# EAGLE design wireless_interface (EAGLE 7.3.0)
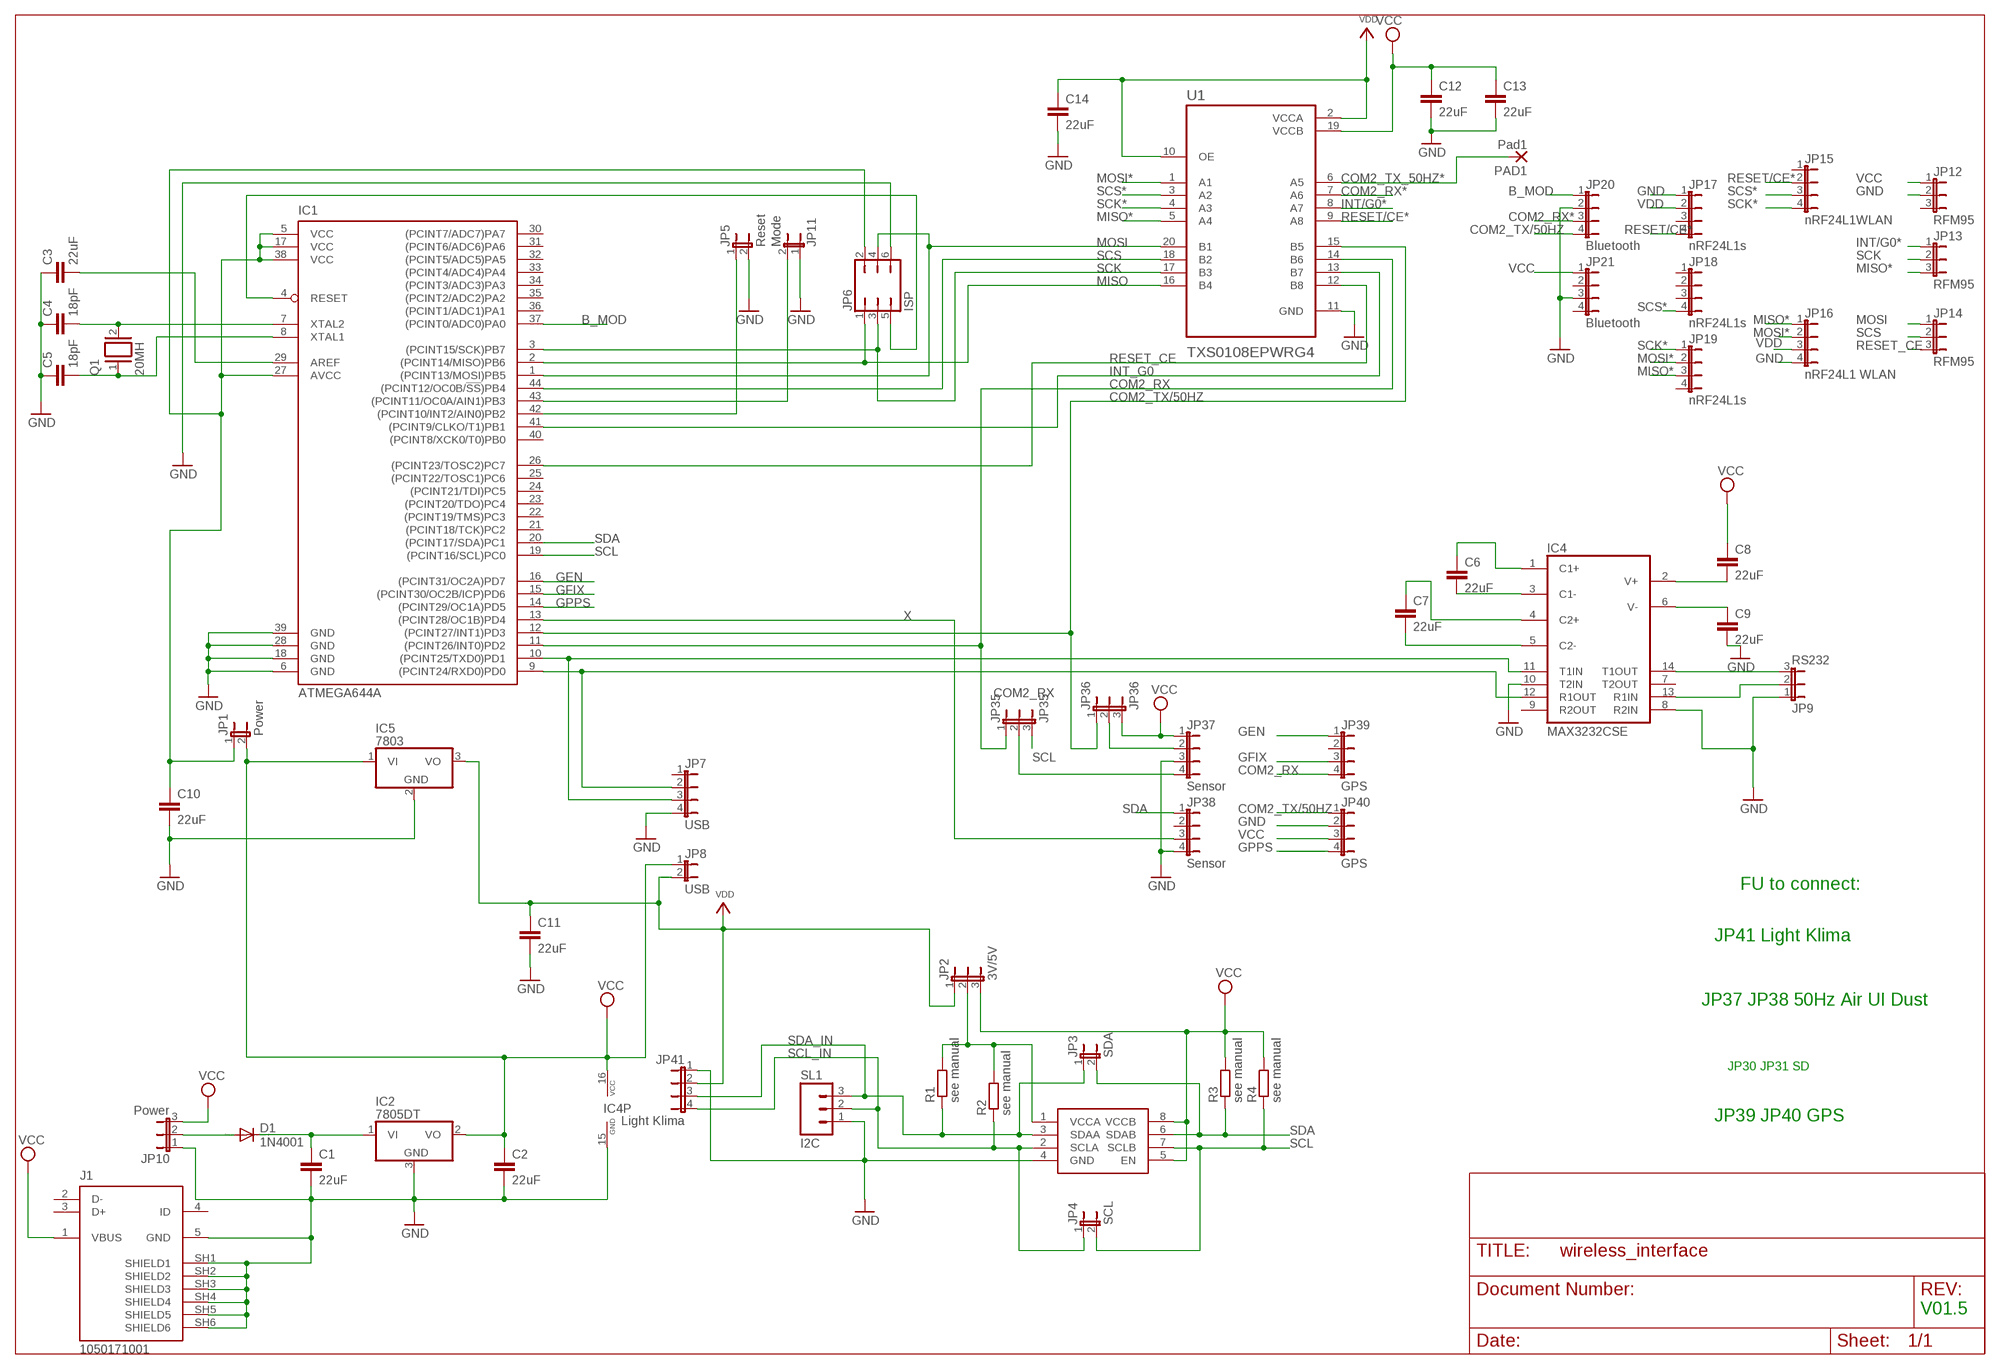
[diagram p0: schematic, sheet 1]

## Parts
C1  22uF  C-EUC1206  [C1206]
C2  22uF  C-EUC1206  [C1206]
C3  22uF  C-EUC1206  [C1206]
C4  18pF  C-EU025-025X050  [C025-025X050]
C5  18pF  C-EU025-025X050  [C025-025X050]
C6  22uF  C-EUC1206  [C1206]
C7  22uF  C-EUC1206  [C1206]
C8  22uF  C-EUC1206  [C1206]
C9  22uF  C-EUC1206  [C1206]
C10  22uF  C-EUC1206  [C1206]
C11  22uF  C-EUC1206  [C1206]
C12  22uF  C-EUC1206  [C1206]
C13  22uF  C-EUC1206  [C1206]
C14  22uF  C-EUC1206  [C1206]
D1  1N4001  DIODE-SOD106-W  [SOD106-W]
IC1  ATMEGA644A  [TQFP44]
IC2  7805DT  [TO252]
IC3  PCA9517  [SO-08]
IC4  MAX3232CSE  [SO16]
IC5  7803  7805TV  [TO220V]
J1  1050171001  [MOLEX_1050171001]
JP1  Power  JP1E  [JP1]
JP2  3V/5V  JP2E  [JP2]
JP3  SDA  JP1E  [JP1]
JP4  SCL  JP1E  [JP1]
JP5  Reset  JP1E  [JP1]
JP6  ISP  JP3Q  [JP3Q]
JP7  USB  JP4E  [JP4]
JP8  USB  JP1E  [JP1]
JP9  RS232  JP2E  [JP2]
JP10  Power  JP2E  [JP2]
JP11  Mode  JP1E  [JP1]
JP12  RFM95  JP2E  [JP2]
JP13  RFM95  JP2E  [JP2]
JP14  RFM95  JP2E  [JP2]
JP15  nRF24L1WLAN  JP4E  [JP4]
JP16  nRF24L1 WLAN  JP4E  [JP4]
JP17  nRF24L1s  JP4E  [JP4]
JP18  nRF24L1s  JP4E  [JP4]
JP19  nRF24L1s  JP4E  [JP4]
JP20  Bluetooth  JP4E  [JP4]
JP21  Bluetooth  JP4E  [JP4]
JP35  JP35  JP2E  [JP2]
JP36  JP36  JP2E  [JP2]
JP37  Sensor  JP4E  [JP4]
JP38  Sensor  JP4E  [JP4]
JP39  GPS  JP4E  [JP4]
JP40  GPS  JP4E  [JP4]
JP41  Light Klima  JP4E  [JP4]
PAD1  Pad1  WIREPADSMD1,27-254  [SMD1,27-2,54]
Q1  20MH  XTAL/S  [QS]
R1  see manual  R-EU_R1206  [R1206]
R2  see manual  R-EU_R1206  [R1206]
R3  see manual  R-EU_R1206  [R1206]
R4  see manual  R-EU_R1206  [R1206]
SL1  I2C  M03  [03P]
U1  TXS0108EPWRG4  [SOP65P640X120-20N]

## Nets
B_MOD: IC1.37((PCINT0/ADC0)PA0) JP20.1
COM2_RX: IC1.11((PCINT26/INT0)PD2) JP35.1 JP39.4 U1.14(B6)
COM2_RX*: JP20.3 U1.7(A6)
COM2_TX/50HZ: IC1.12((PCINT27/INT1)PD3) JP20.4 JP36.1 JP40.1 U1.15(B5)
COM2_TX_50HZ*: PAD1.1(P) U1.6(A5)
GEN: IC1.16((PCINT31/OC2A)PD7) JP39.1
GFIX: IC1.15((PCINT30/OC2B/ICP)PD6) JP39.3
GND: C1.2 C2.2 C3.1 C4.1 C5.1 C9.2 C10.2 C11.2 C12.2 C13.2 C14.2 IC1.6(GND) IC1.18(GND) IC1.28(GND) IC1.39(GND) IC2.3(GND) IC3.4(GND) IC4.8(R2IN) IC4.10(T2IN) IC4.15(GND) IC5.2(GND) J1.5(GND) J1.SH1(SHIELD1) J1.SH2(SHIELD2) J1.SH3(SHIELD3) J1.SH4(SHIELD4) J1.SH5(SHIELD5) J1.SH6(SHIELD6) JP5.2 JP6.6 JP7.4 JP9.1 JP10.1 JP11.1 JP12.2 JP16.4 JP17.1 JP20.2 JP21.3 JP37.3 JP38.4 JP40.2 JP41.1 SL1.1 U1.11(GND)
GPPS: IC1.14((PCINT29/OC1A)PD5) JP40.4
INT/G0*: JP13.1 U1.8(A7)
INT_G0: IC1.41((PCINT9/CLKO/T1)PB1) U1.13(B7)
MISO: IC1.2((PCINT14/MISO)PB6) JP6.1 U1.16(B4)
MISO*: JP13.3 JP16.1 JP19.3 U1.5(A4)
MOSI: IC1.1((PCINT13/MOSI)PB5) JP6.4 JP14.1 U1.20(B1)
MOSI*: JP16.2 JP19.2 U1.1(A1)
N$1: JP36.2 JP37.2
N$2: C10.1 IC1.5(VCC) IC1.17(VCC) IC1.27(AVCC) IC1.38(VCC) JP1.1 JP6.2
N$3: IC4.13(R1IN) JP9.2
N$4: IC1.9((PCINT24/RXD0)PD0) IC4.12(R1OUT) JP7.2
N$5: IC1.42((PCINT10/INT2/AIN0)PB2) JP5.1
N$6: IC1.43((PCINT11/OC0A/AIN1)PB3) JP11.2
N$7: C6.1 IC4.1(C1+)
N$8: C6.2 IC4.3(C1-)
N$9: C7.1 IC4.4(C2+)
N$10: C7.2 IC4.5(C2-)
N$11: D1.A JP10.2
N$12: C8.2 IC4.2(V+)
N$13: C3.2 IC1.29(AREF)
N$14: C9.1 IC4.6(V-)
N$16: IC4.14(T1OUT) JP9.3
N$17: JP35.2 JP37.4
N$18: IC1.4(RESET) JP6.5
N$19: C4.2 IC1.7(XTAL2) Q1.2
N$28: IC1.10((PCINT25/TXD0)PD1) IC4.11(T1IN) JP7.3
N$35: C1.1 D1.C IC2.1(VI)
N$37: C5.2 IC1.8(XTAL1) Q1.1
N$41: IC3.1(VCCA) JP2.2 R1.2 R2.2
RESET/CE*: JP15.2 JP17.4 U1.9(A8)
RESET_CE: IC1.26((PCINT23/TOSC2)PC7) JP14.3 U1.12(B8)
SCK: IC1.3((PCINT15/SCK)PB7) JP6.3 JP13.2 U1.17(B3)
SCK*: JP15.4 JP19.1 U1.4(A3)
SCL: IC1.19((PCINT16/SCL)PC0) IC3.7(SCLB) JP4.2 JP35.3 R4.1
SCL_IN: IC3.2(SCLA) JP4.1 JP41.4 R2.1 SL1.2
SCS: IC1.44((PCINT12/OC0B/!SS!)PB4) JP14.2 U1.18(B2)
SCS*: JP15.3 JP18.4 U1.3(A2)
SDA: IC1.20((PCINT17/SDA)PC1) IC3.6(SDAB) JP3.2 JP38.1 R3.1
SDA_IN: IC3.3(SDAA) JP3.1 JP41.3 R1.1 SL1.3
VCC: C2.1 C8.1 C12.1 C13.1 IC2.2(VO) IC3.5(EN) IC3.8(VCCB) IC4.16(VCC) IC5.1(VI) J1.1(VBUS) JP1.2 JP2.3 JP8.1 JP10.3 JP12.1 JP21.1 JP36.3 JP37.1 JP40.3 R3.2 R4.2 U1.19(VCCB)
VDD: C11.1 C14.1 IC5.3(VO) JP2.1 JP8.2 JP16.3 JP17.2 JP41.2 U1.2(VCCA) U1.10(OE)
X: IC1.13((PCINT28/OC1B)PD4) JP38.3
Unconnected: IC1.21((PCINT18/TCK)PC2) IC1.22((PCINT19/TMS)PC3) IC1.23((PCINT20/TDO)PC4) IC1.24((PCINT21/TDI)PC5) IC1.25((PCINT22/TOSC1)PC6) IC1.30((PCINT7/ADC7)PA7) IC1.31((PCINT6/ADC6)PA6) IC1.32((PCINT5/ADC5)PA5) IC1.33((PCINT4/ADC4)PA4) IC1.34((PCINT3/ADC3)PA3) IC1.35((PCINT2/ADC2)PA2) IC1.36((PCINT1/ADC1)PA1) IC1.40((PCINT8/XCK0/T0)PB0) IC4.7(T2OUT) IC4.9(R2OUT) J1.2(D-) J1.3(D+) J1.4(ID) JP7.1 JP12.3 JP15.1 JP17.3 JP18.1 JP18.2 JP18.3 JP19.4 JP21.2 JP21.4 JP38.2 JP39.2

## Notes on the sheet
- FU to connect:
- JP41 Light Klima
- JP37 JP38 50Hz Air UI Dust
- JP30 JP31 SD
- JP39 JP40 GPS
- V01.5

## Library data of the parts
C1-C3 C6-C14 = rcl:C-EU: CAPACITOR, European symbol
C4 C5 = resistor:C-EU: CAPACITOR, European symbol
D1 = diode:DIODE-: DIODE
IC1 = atmel:ATMEGA644: 8-bit Microcontroller with 64K Bytes In-System Programmable Flash Source: http://www.atmel.com/dyn/resources/prod_documents/doc2593.pdf; MPN: ATMEGA644PV-10AU; OC_FARNELL: 1455123; OC_NEWARK: 58M3748
IC2 IC5 = linear:78*: Positive VOLTAGE REGULATOR Source: http://cache.national.com/ds/LM/LM78L05.pdf http://www.fairchildsemi.com/ds/LM/LM7805.pdf
IC3 = PCA9517:PCA9517
IC4 = maxim:MAX3232*: True RS-232 Transceivers 3.0V to 5.5V, Low-Power up to 1Mbps, Using Four 0.1µF External Capacitors Source: http://pdfserv.maxim-ic.com/en/ds/MAX3222-MAX3241.pdf; MPN: MAX3232CSE; OC_FARNELL: 9725490; OC_NEWARK: 90C2890
J1 = 1050171001:1050171001: Check availability <https://pricing.snapeda.com/parts/1050171001/Molex/view-part?ref=eda>; AVAILABILITY: In Stock; CHECK_PRICES: https://www.snapeda.com/parts/1050171001/Molex/view-part/?ref=eda; DESCRIPTION: USB - micro B USB 2.0 Receptacle Connector 5 Position Surface Mount, Right Angle; MF: Molex; MP: 1050171001; PACKAGE: None; PRICE: None; SNAPEDA_LINK: https://www.snapeda.com/parts/1050171001/Molex/view-part/?ref=snap
JP1 JP3-JP5 JP8 JP11 = jumper:JP1E: JUMPER
JP2 JP9 JP10 JP12-JP14 JP35 JP36 = jumper:JP2E: JUMPER
JP6 = jumper:JP3Q: JUMPER
JP7 JP15-JP21 JP37-JP41 = jumper:JP4E: JUMPER
PAD1 = wirepad:WIREPAD: Wire PAD connect wire on PCB
Q1 = special:XTAL/S: CRYSTAL
R1-R4 = resistor:R-EU_: RESISTOR, European symbol
SL1 = con-amp-quick:M03: AMP QUICK CONNECTOR; OC_FARNELL: unknown; OC_NEWARK: unknown
U1 = TXS0108EPWRG4:TXS0108EPWRG4: Check availability <https://pricing.snapeda.com/parts/TXS0108EPWRG4/Texas%20Instruments/view-part?ref=eda>; AVAILABILITY: In Stock; CHECK_PRICES: https://www.snapeda.com/parts/TXS0108EPWRG4/Texas+Instruments/view-part/?ref=eda; DESCRIPTION: 8-bit bidirectional voltage-level shifter for open-drain and push-pull application 20-TSSOP -40 to 85; MF: Texas Instruments; MP: TXS0108EPWRG4; PACKAGE: TSSOP-20 Texas Instruments; PRICE: None; SNAPEDA_LINK: https://www.snapeda.com/parts/TXS0108EPWRG4/Texas+Instruments/view-part/?ref=snap

## Board
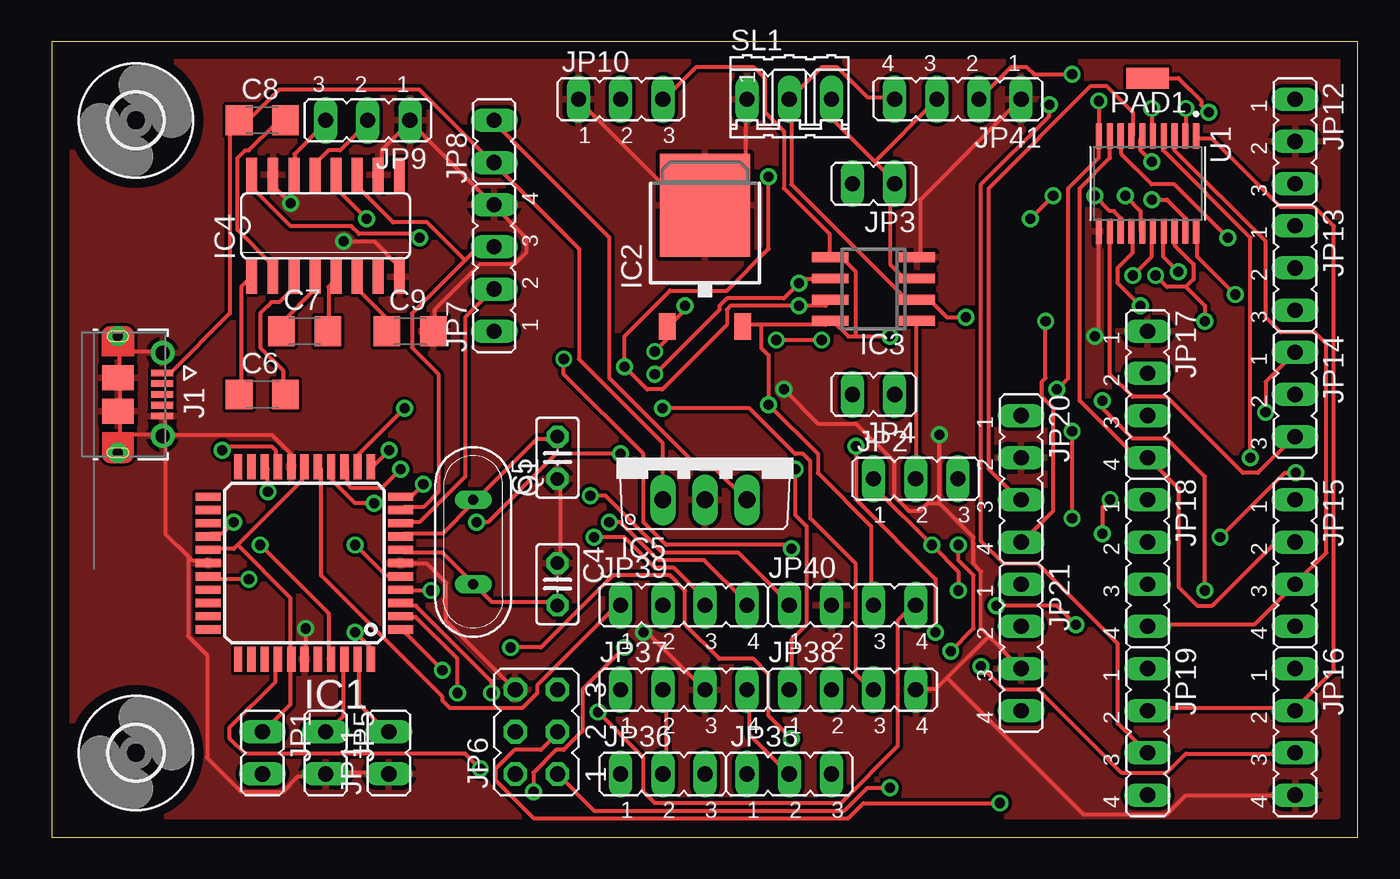
[diagram p1: board, top side]
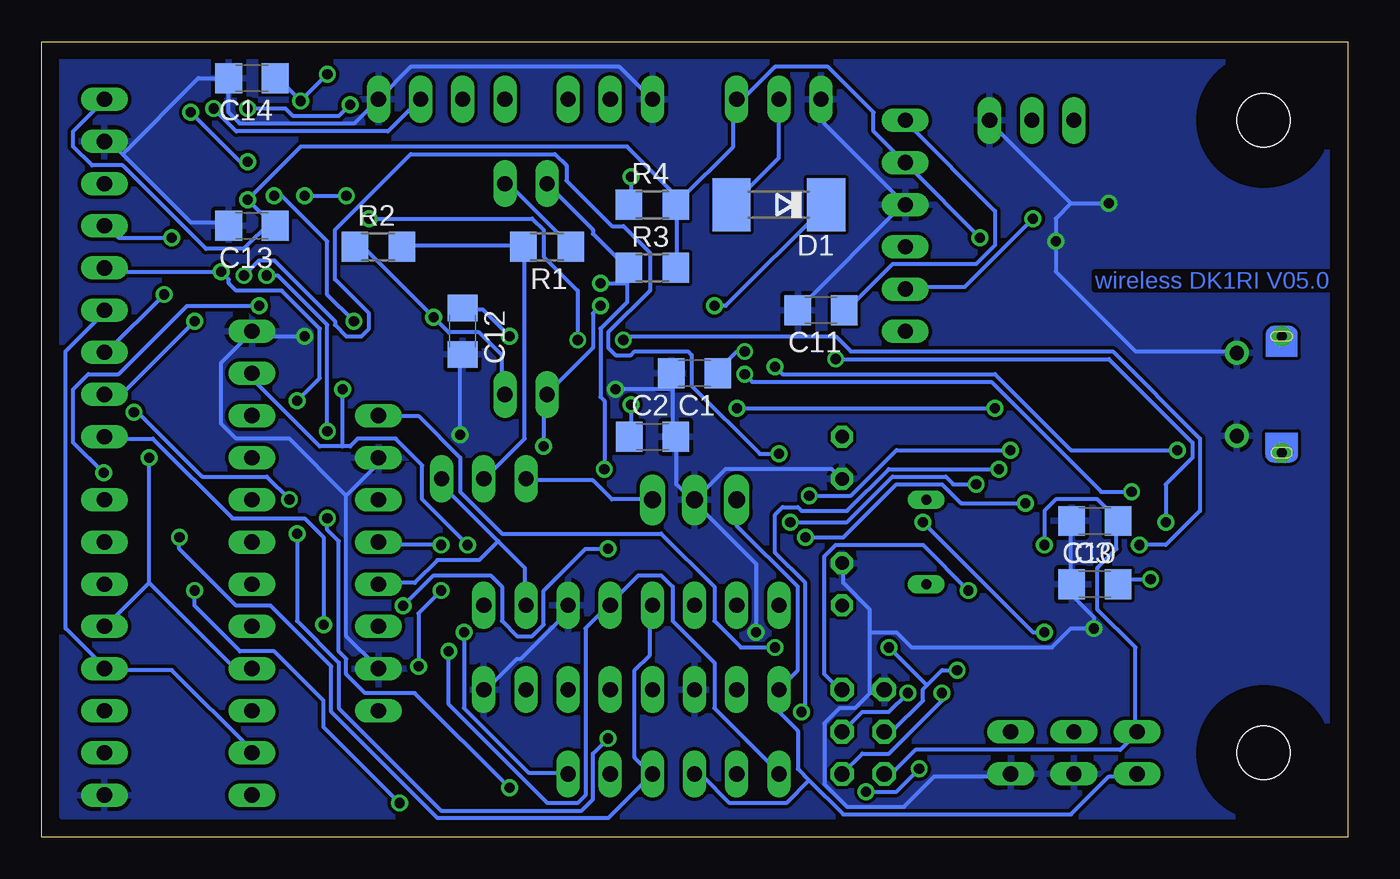
[diagram p2: board, bottom side, seen from below]

Size 78.72 x 47.93 mm. Coordinates in mm from the lower left corner, seen from the top.
Outline: 0,0 78.72,0 78.72,47.93 0,47.93 0,0
Copper layers (1*16): Top 0.035mm / dielectric 1.5mm / Bottom 0.035mm
Design rules "default": minimum track width 10mil, minimum drill 24mil, track to track 8mil, track to pad 8mil, pad to pad 8mil, via to via 8mil, smd to smd 8mil, copper to edge 40mil, drill to drill 8mil, minimum pad ring 10mil, minimum via ring 8mil, stop-mask expansion 4mil, vias tented up to drill 0mil, thermal gap 10mil

### Footprints (pad centres in the part's own frame; a part is rotated, then mirrored left to right if it is on the bottom)
C1206 = smd 1.6 x 1.8: 1 -1.4,0; 2 1.4,0
C025-025X050 = drill 0.813 octagon: 1 -1.27,0; 2 1.27,0
SOD106-W = smd 2.3 x 3.2: A 2.85,0; C -2.85,0
TQFP44 = smd 1.5 x 0.5: 1 -5.8,4; 2 -5.8,3.2; 3 -5.8,2.4; 4 -5.8,1.6; 5 -5.8,0.8; 6 -5.8,0; 7 -5.8,-0.8; 8 -5.8,-1.6; 9 -5.8,-2.4; 10 -5.8,-3.2; 11 -5.8,-4; 23 5.8,-4; 24 5.8,-3.2; 25 5.8,-2.4; 26 5.8,-1.6; 27 5.8,-0.8; 28 5.8,0; 29 5.8,0.8; 30 5.8,1.6; 31 5.8,2.4; 32 5.8,3.2; 33 5.8,4 | smd 0.5 x 1.5: 12 -4,-5.8; 13 -3.2,-5.8; 14 -2.4,-5.8; 15 -1.6,-5.8; 16 -0.8,-5.8; 17 0,-5.8; 18 0.8,-5.8; 19 1.6,-5.8; 20 2.4,-5.8; 21 3.2,-5.8; 22 4,-5.8; 34 4,5.8; 35 3.2,5.8; 36 2.4,5.8; 37 1.6,5.8; 38 0.8,5.8; 39 0,5.8; 40 -0.8,5.8; 41 -1.6,5.8; 42 -2.4,5.8; 43 -3.2,5.8; 44 -4,5.8
TO252 = smd 1 x 1.6: 1 -2.28,-4.8; 2 2.28,-4.8 | smd 5.4 x 6.2: 3 0,2.5
SO-08 = smd 0.6 x 2.2: 1 -1.905,-2.6; 2 -0.635,-2.6; 3 0.635,-2.6; 4 1.905,-2.6; 5 1.905,2.6; 6 0.635,2.6; 7 -0.635,2.6; 8 -1.905,2.6
SO16 = smd 0.66 x 2.032: 1 -4.445,-3.073; 2 -3.175,-3.073; 3 -1.905,-3.073; 4 -0.635,-3.073; 5 0.635,-3.073; 6 1.905,-3.073; 7 3.175,-3.073; 8 4.445,-3.073; 9 4.445,3.073; 10 3.175,3.073; 11 1.905,3.073; 12 0.635,3.073; 13 -0.635,3.073; 14 -1.905,3.073; 15 -3.175,3.073; 16 -4.445,3.073
TO220V = drill 1.016 long: 1 -2.54,-2.54; 2 0,-2.54; 3 2.54,-2.54
MOLEX_1050171001 = smd 0.4 x 1.35: 1 -1.3,4.125; 2 -0.65,4.125; 3 0,4.125; 4 0.65,4.125; 5 1.3,4.125 | drill 0.85 pad 1.45: SH1 -2.5,4.15; SH2 2.5,4.15 | drill 0.6 pad 1.2: SH3 -3.5,1.45; SH6 3.5,1.45 | smd 1.5 x 1.9: SH4 -1,1.45; SH5 1,1.45
JP1 = drill 0.914 long: 1 0,-1.27; 2 0,1.27
JP2 = drill 0.914 long: 1 -2.54,0; 2 0,0; 3 2.54,0
JP3Q = drill 0.914 octagon: 1 -2.54,-1.27; 2 -2.54,1.27; 3 0,-1.27; 4 0,1.27; 5 2.54,-1.27; 6 2.54,1.27
JP4 = drill 0.914 long: 1 -3.81,0; 2 -1.27,0; 3 1.27,0; 4 3.81,0
SMD1,27-2,54 = smd 1.27 x 2.54: 1 0,0
QS = drill 0.61 long: 1 -2.54,0; 2 2.54,0
R1206 = smd 1.6 x 1.803: 1 -1.422,0; 2 1.422,0
03P = drill 0.914 long: 1 -2.54,0; 2 0,0; 3 2.54,0
SOP65P640X120-20N = smd 1.57 x 0.41: 1 -2.87,2.925; 2 -2.87,2.275; 3 -2.87,1.625; 4 -2.87,0.975; 5 -2.87,0.325; 6 -2.87,-0.325; 7 -2.87,-0.975; 8 -2.87,-1.625; 9 -2.87,-2.275; 10 -2.87,-2.925; 11 2.87,-2.925; 12 2.87,-2.275; 13 2.87,-1.625; 14 2.87,-0.975; 15 2.87,-0.325; 16 2.87,0.325; 17 2.87,0.975; 18 2.87,1.625; 19 2.87,2.275; 20 2.87,2.925
3,2 = hole 3.2: 0,0

### Placement (x,y rotation side)
C1  39.37,27.94 180 bottom
C2  41.91,24.13 0 bottom
C3  15.24,15.24 0 bottom
C4  30.48,15.24 270 top
C5  30.48,22.86 90 top
C6  12.7,26.67 0 top
C7  15.24,30.48 0 top
C8  12.7,43.18 0 top
C9  21.59,30.48 0 top
C10  15.24,19.05 180 bottom
C11  31.75,31.75 180 bottom
C12  53.34,30.48 270 bottom
C13  66.04,36.83 180 bottom
C14  66.04,45.72 180 bottom
D1  34.29,38.1 180 bottom
IC1  15.24,16.51 180 top
IC2  39.37,35.56 0 top
IC3  49.53,33.02 90 top
IC4  16.51,36.83 0 top
IC5  39.37,22.86 0 top
J1  2.54,26.67 270 top
JP1  12.7,5.08 180 top
JP2  52.07,21.59 0 top
JP3  49.53,39.37 90 top
JP4  49.53,26.67 90 top
JP5  16.51,5.08 180 top
JP6  29.21,6.35 90 top
JP7  26.67,34.29 90 top
JP8  26.67,41.91 0 top
JP9  19.05,43.18 180 top
JP10  34.29,44.45 0 top
JP11  20.32,5.08 0 top
JP12  74.93,41.91 270 top
JP13  74.93,34.29 270 top
JP14  74.93,26.67 270 top
JP15  74.93,16.51 270 top
JP16  74.93,6.35 270 top
JP17  66.04,26.67 270 top
JP18  66.04,16.51 270 top
JP19  66.04,6.35 270 top
JP20  58.42,21.59 270 top
JP21  58.42,11.43 270 top
JP35  44.45,3.81 0 top
JP36  36.83,3.81 0 top
JP37  38.1,8.89 0 top
JP38  48.26,8.89 0 top
JP39  38.1,13.97 0 top
JP40  48.26,13.97 0 top
JP41  54.61,44.45 180 top
PAD1  66.04,45.72 90 top
Q1  25.4,17.78 270 top
R1  48.26,35.56 180 bottom
R2  58.42,35.56 0 bottom
R3  41.91,34.29 0 bottom
R4  41.91,38.1 0 bottom
SL1  44.45,44.45 0 top
U1  66.04,39.37 270 top
U$3  [3,2]  5.08,43.18 0 top
U$5  [3,2]  5.08,5.08 0 top

### Tracks (layer width: path | path; a pad name or v marks a point on that pad's centre or on a via)
B_MOD  (via drill 0.61)
  Top 0.254: v25.83,4.12 24.92,5.03 11.66,5.03 10.74,5.94 10.74,6.63 13.49,9.37 13.49,10.52 IC1.37 | v29.03,2.74 29.03,3.89 30.4,5.26 30.86,5.26 32,6.4 32,8.91 v34.52,11.43
  Bottom 0.254: v25.83,4.12 27.2,2.74 v29.03,2.74 | v34.52,11.43 36.58,11.43 38.18,13.03 38.18,15.09 41.38,18.29 50.98,18.29 53.49,20.8 53.49,22.86 56.01,25.38 58.29,25.38 JP20.1
COM2_RX  (via drill 0.61)
  Top 0.254: v22.4,21.26 21.72,20.57 21.26,20.57 IC1.11 | v33.6,18.97 34.29,18.97 36.58,16.69 39.32,16.69 41.83,14.17 JP39.4 | v65.61,32 64.24,33.38 64.24,34.29 65.15,35.2 65.15,36.35 U1.14 | v74.98,21.95 74.3,21.95 v70.41,18.06
  Bottom 0.254: v22.4,21.26 23.77,21.26 24.23,21.72 27.43,21.72 30.18,18.97 v33.6,18.97 | v65.61,32 69.95,32 74.07,27.89 75.89,27.89 76.81,26.98 76.81,23.77 v74.98,21.95 | v70.41,18.06 70.41,17.37 66.98,13.95 64.92,13.95 61.27,10.29 61.27,7.54 54.86,1.14 44.58,1.14 JP35.1 42.06,3.89 42.98,4.8 42.98,10.06 42.06,10.97 42.06,13.95 JP39.4
COM2_RX*
  Top 0.254: U1.7 65.15,42.29 65.15,43.66 63.55,45.26 62.64,45.26 56.46,39.09 56.46,22.17 58.29,20.34 JP20.3
COM2_TX/50HZ  (via drill 0.61)
  Top 0.254: v64.69,38.63 65.61,37.72 65.61,36.58 U1.15 | v59.89,31.09 59.89,27.66 59.66,27.43 59.66,26.52 60.35,25.83 60.35,19.66 58.52,17.83 JP20.4 | v20.34,23.32 19.43,22.4 IC1.12 | v32.46,20.57 33.38,20.57 36.8,17.14 41.38,17.14 44.35,14.17 JP40.1 | v54.63,17.6 54.63,16.69 55.55,15.77 55.55,12.57 v54.18,11.2
  Bottom 0.254: v64.69,38.63 64.24,38.63 61.49,35.89 61.49,32.69 v59.89,31.09 | v20.34,23.32 27.2,23.32 29.95,20.57 v32.46,20.57 | JP36.1 34.29,3.89 38.18,7.77 38.18,10.52 40.69,13.03 40.69,15.09 41.38,15.77 42.75,15.77 44.35,14.17 JP40.1 44.58,13.95 45.95,12.57 45.95,2.52 46.41,2.06 48.23,2.06 54.18,8 v54.18,11.2 | v54.63,17.6 58.29,17.6 JP20.4
COM2_TX_50HZ*  (via drill 0.61)
  Top 0.254: v66.29,40.69 65.61,41.38 65.61,42.06 U1.6 | v69.72,43.66 69.27,44.12 69.27,44.35 67.89,45.72 PAD1.1
  Bottom 0.254: v66.29,40.69 66.75,40.69 v69.72,43.66
GEN
  Top 0.254: IC1.16 16.23,22.17 16.23,15.77 23.55,8.46 23.55,8.23 24,7.77 28.35,7.77 29.26,8.69 29.26,9.14 34.29,14.17 JP39.1
GFIX  (via drill 0.61)
  Top 0.254: v19.43,20.12 18.29,20.12 16.92,21.49 16.92,22.17 IC1.15 | v32.69,18.06 34.52,18.06 36.35,16.23 37.49,16.23 39.55,14.17 JP39.3
  Bottom 0.254: v19.43,20.12 23.32,20.12 24.46,21.26 27.2,21.26 30.4,18.06 v32.69,18.06
GND  (via drill 0.61)
  Top 0.254: v62.87,30.18 63.09,30.4 63.09,36.35 U1.11 | 53.49,20.12 v53.49,24.23 | 53.49,20.12 55.55,18.06 55.55,16.46 56.01,16 56.01,12.57 56.46,12.12 | JP21.3 56.46,12.12 | 56.46,12.12 53.95,9.6 | 53.95,9.6 53.26,8.91 52.12,8.91 JP38.4 | 53.95,9.6 62.18,1.37 67.21,1.37 68.35,2.52 74.75,2.52 JP16.4 | v35.66,12.34 35.89,12.34 39.32,8.91 JP37.3 | v15.32,12.57 15.32,10.74 IC1.39 | C4.1 30.63,16.69 30.63,21.49 C5.1 | JP11.1 20.12,3.89 16.69,3.89 JP5.2 16.46,3.66 14.86,3.66 13.95,2.74 11.43,2.74 9.37,4.8 9.37,10.97 8.23,12.12 8.23,16.92 | IC1.6 21.26,16.46 22.63,16.46 23.77,15.32 23.77,13.03 27.89,8.91 JP6.6 | IC3.4 52.35,34.98 52.35,38.41 58.29,44.35 JP41.1 | 4.12,24.23 4.12,25.6 J1.SH5 4.12,25.83 4.12,27.66 J1.SH4 4.12,27.89 4.12,29.26 | 4.12,24.23 4.12,23.32 J1.SH6 | 4.12,29.26 4.12,29.95 J1.SH3 | 4.12,29.26 6.63,29.26 J1.SH1 | 6.86,24.23 6.86,25.38 J1.5 | 8.23,16.92 6.86,18.29 6.86,24 J1.SH2 | 8.23,16.92 8.46,16.69 9.37,16.69 IC1.28 | 6.86,24.23 13.26,24.23 14.4,23.09 14.4,22.4 IC1.18 | 6.86,24.23 J1.SH2 | 4.12,24.23 6.63,24.23 J1.SH2 | v14.4,38.18 13.49,39.09 13.49,39.78 IC4.15 | IC4.10 19.89,40.01 19.89,41.38 21.49,42.98 JP9.1 21.72,42.98 26.52,38.18 JP7.4 26.75,37.95 28.57,36.12 28.57,35.2 27.89,34.52 25.83,34.52 23.09,31.77 23.09,30.63 C9.2 | v17.6,35.89 19.43,35.89 20.8,34.52 20.8,33.83 IC4.8 | SL1.1 41.83,44.35 41.83,40.46 39.55,38.18 IC2.3 39.32,38.18 37.95,38.18 31.77,44.35 JP10.1 | 53.49,20.12 52.81,20.12 52.35,19.66 51.66,19.66 50.75,20.57 50.75,22.63 48.46,24.92 46.18,24.92 v44.12,26.98
  Bottom 0.254: v62.87,30.18 65.61,30.18 65.84,30.4 JP17.1 66.06,30.4 67.89,28.57 67.89,24.92 66.98,24 63.78,24 60.35,20.57 | v53.49,24.23 53.49,29.03 C12.2 | JP40.2 47.09,13.95 47.09,13.49 49.84,10.74 50.06,10.74 51.89,8.91 JP38.4 | 60.35,20.57 58.52,22.4 58.52,22.86 JP20.2 | 60.35,20.57 60.35,12.12 58.52,10.29 JP21.3 | 40.69,26.98 40.69,27.89 C1.2 | 40.69,26.98 40.69,24.23 C2.2 40.46,24 40.46,21.26 39.55,20.34 IC5.2 | v35.66,12.34 35.66,16.46 39.32,20.12 IC5.2 | C10.2 16.69,18.97 16.69,15.32 C3.1 16.46,15.09 16.46,14.4 15.32,13.26 v15.32,12.57 16.69,12.57 17.83,11.43 26.29,11.43 27.2,12.34 28.8,12.34 | 28.8,8.69 29.72,7.77 30.63,7.77 31.55,6.86 31.55,3.2 30.18,1.83 26.75,1.83 24.92,3.66 20.34,3.66 JP11.1 | 28.8,8.69 28.12,8.69 JP6.6 | 28.8,8.69 28.8,12.34 | 28.8,12.34 28.8,13.72 30.4,15.32 30.4,16.46 C4.1 | IC5.2 39.32,20.34 37.49,22.17 31.09,22.17 30.63,21.72 C5.1 | 73.84,41.15 74.75,42.06 JP12.2 | 73.84,41.15 69.72,37.03 67.67,37.03 C13.2 | 73.84,41.15 69.27,45.72 C14.2 67.44,43.66 66.75,42.98 59.89,42.98 JP41.1 56.46,46.41 43.89,46.41 42.06,44.58 SL1.1 | 16.69,38.18 v14.4,38.18 | 16.69,38.18 21.49,42.98 JP9.1 | 16.69,38.18 17.6,37.26 v17.6,35.89 17.6,34.06 12.8,29.26 6.86,29.26 J1.SH1 | 26.75,38.18 33.15,31.77 C11.2 | 26.75,38.18 31.55,42.98 31.55,44.35 JP10.1 | 26.75,38.18 JP7.4 | 40.69,26.98 v44.12,26.98
  pour Bottom: 1.27,46.99 77.47,46.99 77.47,1.27 1.27,1.27
  pour Top: 1.27,46.99 77.47,46.99 77.47,1.27 1.27,1.27
GPPS  (via drill 0.61)
  Top 0.254: v21.03,22.17 19.89,21.03 18.06,21.03 17.83,21.26 17.83,22.17 IC1.14 | v32.92,7.54 35.66,4.8 35.66,2.74 36.35,2.06 47.55,2.06 50.98,5.49 50.98,13.03 51.89,13.95 JP40.4
  Bottom 0.254: v21.03,22.17 27.66,22.17 30.18,19.66 32.92,19.66 33.15,19.89 34.06,19.89 34.52,19.43 34.52,17.14 32.69,15.32 32.69,7.77 v32.92,7.54
INT/G0*  (via drill 0.61)
  Top 0.254: v70.87,36.12 67.67,39.32 66.29,39.32 64.47,41.15 64.47,42.06 U1.8
  Bottom 0.254: v70.87,36.12 74.07,36.12 74.75,36.8 JP13.1
INT_G0  (via drill 0.61)
  Top 0.254: v12.57,17.6 16.69,13.49 16.69,10.74 IC1.41 | v46.41,29.95 v43.66,29.95 | v60.35,38.63 v58.98,37.26 | v62.87,38.63 63.78,37.72 64.01,37.72 64.47,37.26 64.47,36.58 U1.13
  Bottom 0.254: v12.57,17.6 10.97,17.6 8.91,19.66 8.91,24 14.17,29.26 29.95,29.26 30.86,30.18 43.43,30.18 v43.66,29.95 | v46.41,29.95 46.41,32.92 48.46,34.98 48.46,36.58 49.15,37.26 v58.98,37.26 | v62.87,38.63 v60.35,38.63
MISO  (via drill 0.61)
  Top 0.254: v24.46,8.69 24.46,10.74 21.95,13.26 21.26,13.26 IC1.2 | v65.15,33.83 66.29,34.98 66.29,36.35 U1.16 | v61.49,19.2 v61.49,24.46 | v50.52,2.97 49.15,2.97 47.78,1.6 32.69,1.6 JP6.1
  Bottom 0.254: v24.46,8.69 24.46,8.23 27.66,5.03 29.26,5.03 JP6.1 | v65.15,33.83 64.47,33.83 61.49,30.86 v61.49,24.46 | v61.49,19.2 61.49,18.52 60.81,17.83 60.81,11.2 60.35,10.74 60.35,9.83 59.21,8.69 56.24,8.69 v50.52,2.97
MISO*  (via drill 0.61)
  Top 0.254: v66.29,43.89 66.29,42.29 U1.5 | v60.12,44.12 60.12,43.43 56.01,39.32 56.01,17.83 57.38,16.46 59.44,16.46 64.24,11.66 64.24,6.86 65.84,5.26 JP19.3
  Bottom 0.254: v66.29,43.89 64.01,43.89 63.55,43.43 60.81,43.43 v60.12,44.12 | JP19.3 66.06,5.26 70.87,10.06 74.75,10.06 JP16.1 74.98,10.29 77.27,12.57 77.27,29.26 74.98,31.55 JP13.3
MOSI  (via drill 0.61)
  Top 0.254: v23.55,10.06 21.26,12.34 IC1.1 | v71.32,32.69 69.04,34.98 69.04,36.35 U1.20 | v27.66,11.43 29.49,11.43 33.83,15.77 37.26,15.77 38.18,14.86 38.18,12.8 40.23,10.74 42.29,10.74 43.2,9.83 43.2,7.32 v44.58,5.94 | v63.32,18.29 63.32,19.89 v63.78,20.34 | v73.15,25.6 73.15,27.43 JP14.1
  Bottom 0.254: v23.55,10.06 24.46,10.06 25.38,9.14 | 25.38,9.14 25.6,8.91 25.6,8.23 27.43,6.4 27.89,6.4 JP6.4 | v71.32,32.69 74.75,29.26 JP14.1 | v27.66,11.43 25.38,9.14 | v44.58,5.94 45.49,5.03 45.49,2.29 46.18,1.6 54.63,1.6 60.81,7.77 60.81,10.52 63.32,13.03 v63.32,18.29 | v63.78,20.34 65.15,21.72 69.04,21.72 72.92,25.6 v73.15,25.6
MOSI*
  Top 0.254: U1.1 69.04,42.06 69.95,42.06 74.07,37.95 76.12,37.95 77.27,36.8 77.27,10.06 74.98,7.77 JP16.2 74.75,7.77 66.06,7.77 JP19.2
N$1
  Top 0.254: JP36.2 37.03,3.89 37.03,8.69 JP37.2
N$2  (via drill 0.61)
  Top 0.254: v18.29,17.6 20.12,15.77 21.03,15.77 IC1.5 | 11.2,17.6 15.09,21.49 15.09,22.17 IC1.17 | 11.2,17.6 10.97,17.37 9.6,17.37 IC1.27 | JP1.1 12.8,6.4 14.4,8 14.4,10.52 IC1.38 14.4,10.74 14.4,14.4 11.2,17.6
  Bottom 0.254: v18.29,17.6 18.29,19.66 17.6,20.34 15.09,20.34 13.95,19.2 C10.1 13.95,18.97 13.95,17.37 15.09,16.23 15.09,13.72 12.8,11.43 12.8,6.4 JP1.1 12.8,6.17 13.72,5.26 26.06,5.26 27.43,3.89 27.89,3.89 JP6.2
N$3
  Top 0.254: IC4.13 16,40.01 16,40.69 16.69,41.38 17.37,41.38 18.97,42.98 JP9.2
N$4  (via drill 0.61)
  Top 0.254: IC1.9 21.26,18.97 22.17,18.97 24.92,21.72 24.92,31.32 26.52,32.92 JP7.2 | IC4.12 17.14,39.09 v18.97,37.26
  Bottom 0.254: v18.97,37.26 23.09,33.15 26.52,33.15 JP7.2
N$5
  Top 0.254: IC1.42 17.6,10.52 17.6,7.32 16.69,6.4 JP5.1
N$6
  Top 0.254: IC1.43 18.52,10.52 18.52,8 20.12,6.4 JP11.2
N$7
  Top 0.254: C6.1 11.43,26.75 11.43,33.15 11.89,33.6 IC4.1
N$8
  Top 0.254: C6.2 13.95,26.75 13.95,28.12 12.57,29.49 12.57,31.55 13.26,32.23 13.72,32.23 14.4,32.92 14.4,33.6 IC4.3
N$9
  Top 0.254: C7.1 13.95,30.63 13.95,31.09 15.77,32.92 15.77,33.6 IC4.4
N$10
  Top 0.254: C7.2 16.69,30.63 16.69,33.15 17.14,33.6 IC4.5
N$11
  Bottom 0.254: JP10.2 34.29,40.92 37.03,38.18 D1.A
N$12
  Top 0.254: C8.2 13.95,42.98 13.49,42.98 11.89,41.38 11.66,41.38 11.2,40.92 11.2,36.58 13.26,34.52 13.26,33.83 IC4.2
N$13  (via drill 0.61)
  Top 0.254: v11.89,15.54 9.6,15.54 IC1.29
  Bottom 0.254: v11.89,15.54 13.49,15.54 13.72,15.32 C3.2
N$14
  Top 0.254: C9.1 20.12,30.63 20.12,31.32 18.52,32.92 18.52,33.6 IC4.6
N$16
  Top 0.254: IC4.14 14.63,40.01 14.63,41.15 16.46,42.98 JP9.3
N$17
  Top 0.254: JP37.4 42.06,8.69 42.06,6.17 44.35,3.89 JP35.2
N$18  (via drill 0.61)
  Top 0.254: v22.86,14.86 21.26,14.86 IC1.4
  Bottom 0.254: v22.86,14.86 25.6,17.6 30.86,17.6 31.55,16.92 31.55,9.83 30.63,8.91 JP6.5
N$19
  Top 0.254: IC1.7 21.26,17.14 23.55,17.14 25.38,15.32 Q1.2 25.6,15.09 26.52,14.17 30.4,14.17 C4.2
N$28
  Top 0.254: 24.92,34.75 25.6,35.43 26.52,35.43 JP7.3 | 24.92,34.75 21.72,31.55 21.72,29.49 23.32,27.89 23.32,20.8 22.4,19.89 21.26,19.89 IC1.10 | 24.92,34.75 22.63,37.03 20.57,37.03 18.52,39.09 18.52,39.78 IC4.11
N$35  (via drill 0.61)
  Top 0.254: v36.35,29.26 37.03,29.95 37.03,30.63 IC2.1 37.26,30.86 38.18,31.77 v38.18,32
  Bottom 0.254: v36.35,29.26 36.8,29.26 37.95,28.12 C1.1 | v38.18,32 37.49,32 31.55,37.95 D1.C
N$37
  Top 0.254: IC1.8 21.26,18.29 23.55,18.29 25.38,20.12 Q1.1 25.6,20.34 29.26,24 30.4,24 C5.2
N$41
  Top 0.254: IC3.1 52.12,31.09 52.12,21.72 JP2.2
  Bottom 0.254: R2.2 56.92,35.66 49.84,35.66 R1.2 49.61,35.43 49.61,24 51.89,21.72 JP2.2
RESET/CE*
  Top 0.254: U1.9 63.78,42.06 63.78,40.92 61.95,39.09 61.95,26.29 65.38,22.86 JP17.4 66.06,22.86 67.89,21.03 67.89,15.09 69.04,13.95 69.95,13.95 73.61,17.6 74.75,17.6 JP15.2
RESET_CE  (via drill 0.61)
  Top 0.254: v10.97,18.97 10.29,18.29 9.6,18.29 IC1.26 | v30.86,28.8 30.86,27.89 35.66,23.09 35.66,18.97 37.03,17.6 44.35,17.6 v44.58,17.37 | v56.92,13.95 60.58,13.95 v61.72,12.8 | U1.12 63.78,36.35 63.78,27.89 65.15,26.52 67.21,26.52 71.78,21.95 72.69,21.95 74.75,24 JP14.3
  Bottom 0.254: v10.97,18.97 10.97,21.26 9.37,22.86 9.37,23.77 14.4,28.8 v30.86,28.8 | v44.58,17.37 45.95,17.37 48.46,14.86 48.46,12.8 49.15,12.12 50.06,12.12 50.98,13.03 50.98,15.09 51.66,15.77 55.09,15.77 v56.92,13.95 | v61.72,12.8 61.72,18.06 62.87,19.2 67.21,19.2 72.01,24 74.75,24 JP14.3
SCK  (via drill 0.61)
  Top 0.254: v67.89,34.06 66.98,34.98 66.98,36.35 U1.17 | v26.52,8.69 26.52,9.37 21.95,13.95 21.26,13.95 IC1.3 | v63.32,26.29 63.32,25.83 65.15,24 67.21,24 69.49,21.72 v69.49,14.86 | v57.15,2.06 48.92,2.06 48.01,1.14 29.03,1.14 26.75,3.43 26.75,4.12 27.89,5.26 29.49,5.26 30.4,6.17 JP6.3
  Bottom 0.254: JP13.2 74.75,34.29 74.52,34.06 v67.89,34.06 67.44,33.6 67.44,33.38 66.98,32.92 64.24,32.92 61.95,30.63 61.95,27.66 v63.32,26.29 | v26.52,8.69 27.66,7.54 29.26,7.54 30.4,6.4 JP6.3 | v69.49,14.86 69.49,13.95 66.75,11.2 64.69,11.2 61.72,8.23 61.72,6.63 v57.15,2.06
SCK*  (via drill 0.61)
  Top 0.254: v72.24,22.86 72.24,36.12 66.98,41.38 66.98,42.06 U1.4
  Bottom 0.254: 72.24,15.32 v72.24,22.86 | 72.24,15.32 74.75,12.8 JP15.4 | 72.24,15.32 67.21,10.29 66.06,10.29 JP19.1
SCL  (via drill 0.61)
  Top 0.254: v53.26,12.34 53.26,15.54 48.46,20.34 v48.46,23.55 | v10.29,23.32 10.52,23.55 13.26,23.55 13.49,23.32 13.49,22.4 IC1.19 | IC3.7 46.86,32.23 46.63,32 v45.03,32 40.92,32 40.69,31.77 40.69,30.86 36.8,26.98 35.89,26.98 v34.52,28.35 34.52,30.18 37.26,32.92 40.69,32.92 43.2,35.43 v43.2,39.78
  Bottom 0.254: v53.26,12.34 53.26,7.77 49.38,3.89 47.09,3.89 JP35.3 | v48.46,23.55 48.46,26.52 JP4.2 48.23,26.75 45.49,29.49 45.49,31.55 v45.03,32 | v10.29,23.32 16.69,23.32 21.26,27.89 34.06,27.89 v34.52,28.35 | v43.2,39.78 43.2,38.18 R4.1
SCL_IN  (via drill 0.61)
  Top 0.254: JP41.4 50.75,44.58 49.15,44.58 47.32,46.41 46.41,46.41 SL1.2 44.58,44.35 44.58,39.32 51.44,32.46 52.12,32.46 IC3.2 52.35,32.23 53.03,32.23 53.95,31.32 v55.09,31.32
  Bottom 0.254: R2.1 59.66,35.43 59.21,35.43 v55.09,31.32 54.18,30.4 52.35,30.4 50.98,29.03 50.98,26.75 JP4.1
SCS  (via drill 0.61)
  Top 0.254: v18.29,12.34 19.2,11.43 19.2,10.74 IC1.44 | v25.6,18.97 26.29,18.97 30.4,23.09 v34.29,23.09 | v66.52,33.83 67.21,33.15 68.35,33.15 | 68.35,33.15 68.81,33.6 68.81,34.52 67.67,35.66 67.67,36.35 U1.18 | v69.49,31.09 69.49,32 68.35,33.15
  Bottom 0.254: v18.29,12.34 18.97,12.34 v25.6,18.97 | v34.29,23.09 35.43,23.09 39.55,27.2 39.55,29.03 39.78,29.26 42.98,29.26 43.2,29.03 44.12,29.03 44.58,29.49 44.58,30.4 42.06,32.92 42.06,35.2 43.66,36.8 44.35,36.8 47.09,39.55 47.09,40.46 47.78,41.15 56.46,41.15 61.04,36.58 61.04,33.6 58.98,31.55 58.98,30.63 59.44,30.18 60.35,30.18 61.04,30.86 61.04,31.09 64.69,34.75 65.61,34.75 v66.52,33.83 | v69.49,31.09 73.84,26.75 74.75,26.75 JP14.2
SCS*
  Top 0.254: U1.3 67.67,42.06 67.67,41.38 73.15,35.89 73.15,31.32 74.07,30.4 76.12,30.4 76.81,29.72 76.81,17.14 74.98,15.32 JP15.3 74.75,15.09 72.47,12.8 66.06,12.8 JP18.4
SDA  (via drill 0.61)
  Top 0.254: v44.81,22.17 44.81,19.43 45.49,18.75 45.49,12.8 44.58,11.89 44.58,8.91 JP38.1 | v13.03,20.8 13.03,22.17 IC1.20 | v36.35,27.89 40.23,31.77 40.23,32 40.69,32.46 44.12,32.46 v45.03,33.38 45.26,33.6 46.86,33.6 IC3.6
  Bottom 0.254: 43.43,34.29 45.49,36.35 45.49,36.58 48.23,39.32 JP3.2 | v44.81,22.17 44.81,26.29 45.03,26.52 45.03,30.63 43.43,32.23 43.43,33.38 | 43.43,34.29 43.43,33.38 | 43.43,34.29 R3.1 | v13.03,20.8 14.86,20.8 21.49,27.43 35.89,27.43 v36.35,27.89 | v45.03,33.38 43.43,33.38
SDA_IN
  Top 0.254: IC3.3 52.12,33.83 51.21,33.83 50.52,34.52 50.52,39.09 JP3.1 50.75,39.55 49.61,40.69 | 49.61,40.69 47.09,43.2 47.09,44.35 SL1.3 | 49.61,40.69 53.26,44.35 JP41.3
  Bottom 0.254: R1.1 46.86,35.66 50.75,39.55 JP3.1
VCC  (via drill 0.61)
  Top 0.254: 42.75,30.86 46.63,30.86 46.86,31.09 IC3.8 47.09,31.09 48.01,30.18 48.46,30.18 | 42.75,30.86 41.83,30.86 IC2.2 | 42.75,30.86 42.75,29.49 43.2,29.03 v43.2,26.06 46.18,23.09 46.18,21.95 49.38,18.75 49.38,14.17 JP40.3 | 48.46,30.18 v50.52,30.18 | 48.46,30.18 48.46,34.06 47.78,34.75 47.09,34.75 IC3.5 46.86,34.98 46.86,36.35 44.12,39.09 44.12,42.52 42.98,43.66 42.98,45.72 42.29,46.41 38.86,46.41 37.03,44.58 JP10.3 | v66.29,38.41 67.21,38.41 68.35,37.26 68.35,36.58 U1.19 | J1.1 6.86,27.89 7.09,27.89 10.74,31.55 10.74,42.52 11.2,42.98 C8.1 11.43,43.2 11.89,43.2 13.72,45.03 22.17,45.03 26.52,40.69 JP8.1 26.75,40.46 31.77,35.43 31.77,28.8 36.8,23.77 36.8,20.34 IC5.1 | v22.17,36.12 21.95,36.35 18.52,36.35 18.06,36.8 14.4,36.8 12.12,39.09 12.12,39.78 IC4.16
  Bottom 0.254: 32.46,3.43 33.15,4.12 33.15,6.4 34.29,7.54 JP37.1 34.29,8.91 33.15,10.06 33.15,15.09 36.8,18.75 36.8,20.12 IC5.1 | 32.46,3.43 30.4,1.37 16.69,1.37 14.4,3.66 12.8,3.66 JP1.2 | 32.46,3.43 33.83,2.06 37.26,2.06 38.86,3.66 39.32,3.66 JP36.3 | 51.21,17.83 54.41,21.03 54.41,21.49 JP2.3 | 51.21,17.83 49.61,16.23 49.61,14.17 JP40.3 | 51.21,17.83 52.35,16.69 54.86,16.69 56.24,15.32 58.29,15.32 JP21.1 | v43.2,26.06 43.2,24.23 C2.1 | v50.52,30.18 52.12,31.77 53.26,31.77 C12.1 | 64.92,37.03 64.69,36.8 C13.1 64.92,37.03 | 64.92,37.03 v66.29,38.41 63.09,41.6 43.43,41.6 40.23,38.41 | 64.92,37.03 66.52,35.43 68.81,35.43 73.84,40.46 75.67,40.46 76.81,41.6 76.81,42.52 74.98,44.35 JP12.1 | R3.2 40.46,34.29 40.46,37.95 R4.2 | 40.23,38.41 40.46,38.18 R4.2 | 40.23,38.41 37.03,41.6 37.03,44.35 JP10.3 36.8,44.58 36.35,44.58 34.52,46.41 31.32,46.41 28.57,43.66 28.57,42.52 26.75,40.69 JP8.1 26.52,40.46 v22.17,36.12 | 40.23,38.41 R4.2
VDD  (via drill 0.61)
  Top 0.254: v63.09,44.35 63.09,42.29 U1.10 63.09,42.06 63.09,40.92 61.27,39.09 61.27,27.66 v60.58,26.98 | v68.35,43.89 68.35,42.29 U1.2 | v61.49,45.95 59.21,45.95 58.75,46.41 57.84,46.41 JP41.2 | v56.01,10.29 57.38,8.91 59.44,8.91 64.47,3.89 67.21,3.89 68.35,5.03 74.75,5.03 JP16.3 | v54.63,14.86 54.63,16 v53.03,17.6 49.61,21.03 49.61,21.49 JP2.1 | JP8.2 26.75,42.98 33.6,36.12 33.6,27.66 39.09,22.17 40.01,22.17 41.83,20.34 IC5.3
  Bottom 0.254: C11.1 30.18,31.77 27.43,34.52 22.4,34.52 21.26,35.66 21.26,37.72 26.52,42.98 JP8.2 | C14.1 64.47,45.72 v63.09,44.35 v61.49,45.95 | v68.35,43.89 66.98,42.52 57.84,42.52 56.01,44.35 JP41.2 | JP2.1 49.38,21.49 45.49,21.49 44.35,20.34 42.06,20.34 IC5.3 | v56.01,10.29 56.01,13.49 v54.63,14.86 | 60.58,23.55 60.12,23.55 59.66,24 57.38,24 55.78,22.4 55.78,20.34 v53.03,17.6 | 60.58,23.55 61.95,23.55 65.84,27.43 65.84,27.89 JP17.2 | 60.58,23.55 v60.58,26.98
X  (via drill 0.61)
  Top 0.254: v21.26,25.83 18.52,23.09 18.52,22.4 IC1.13 | v36.8,25.83 42.06,25.83 44.81,23.09 45.26,23.09 45.72,22.63 45.72,19.2 48.46,16.46 48.46,9.83 49.38,8.91 JP38.3
  Bottom 0.254: v36.8,25.83 v21.26,25.83

### Text on the board
Bottom: wireless DK1RI V05.0